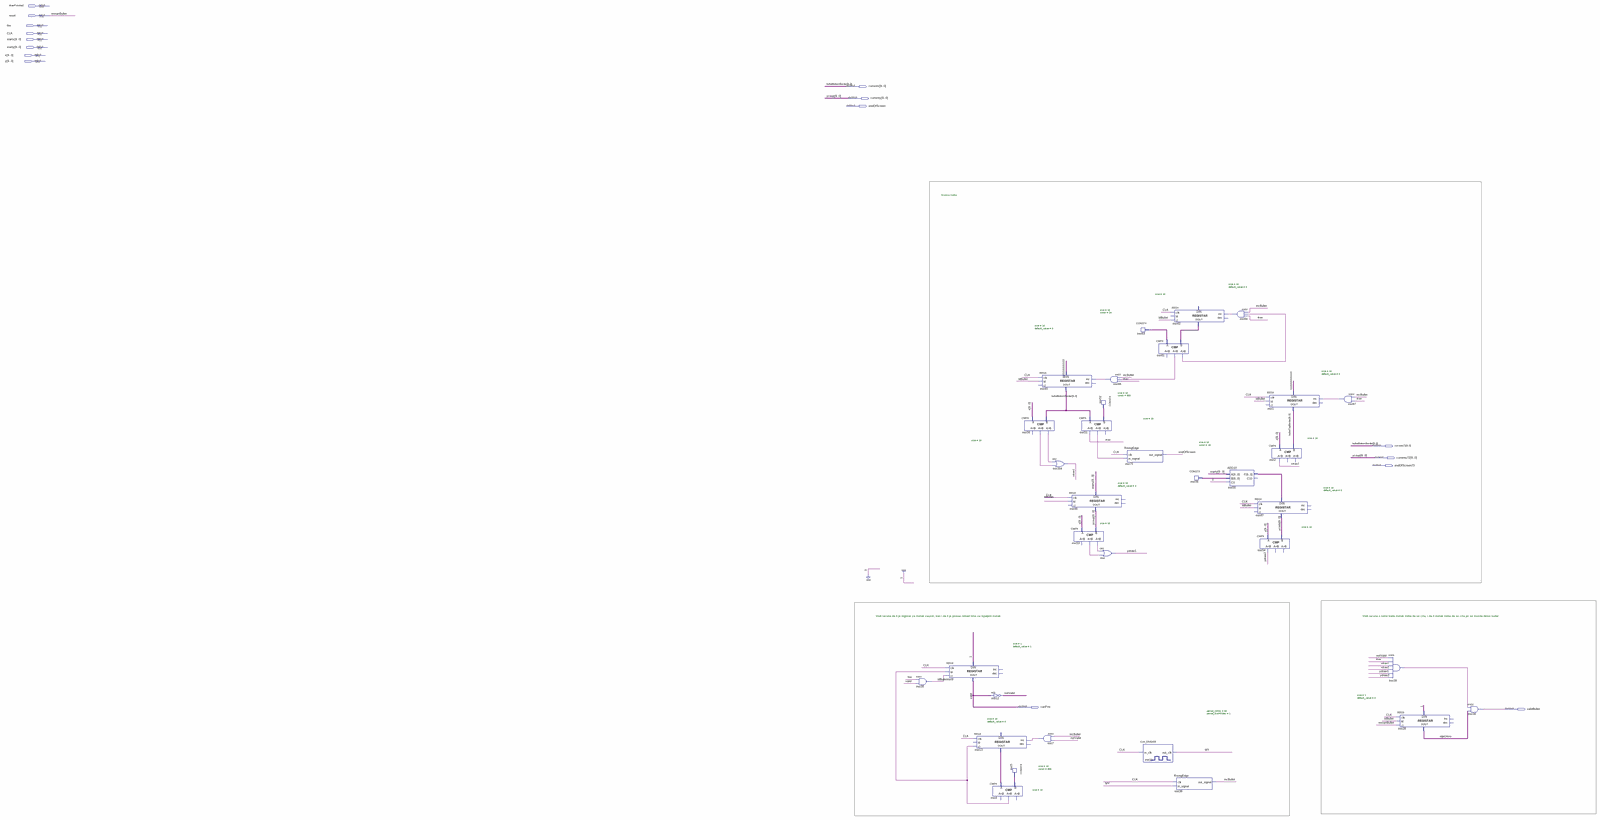
[diagram p0: schematic sheet, whole]
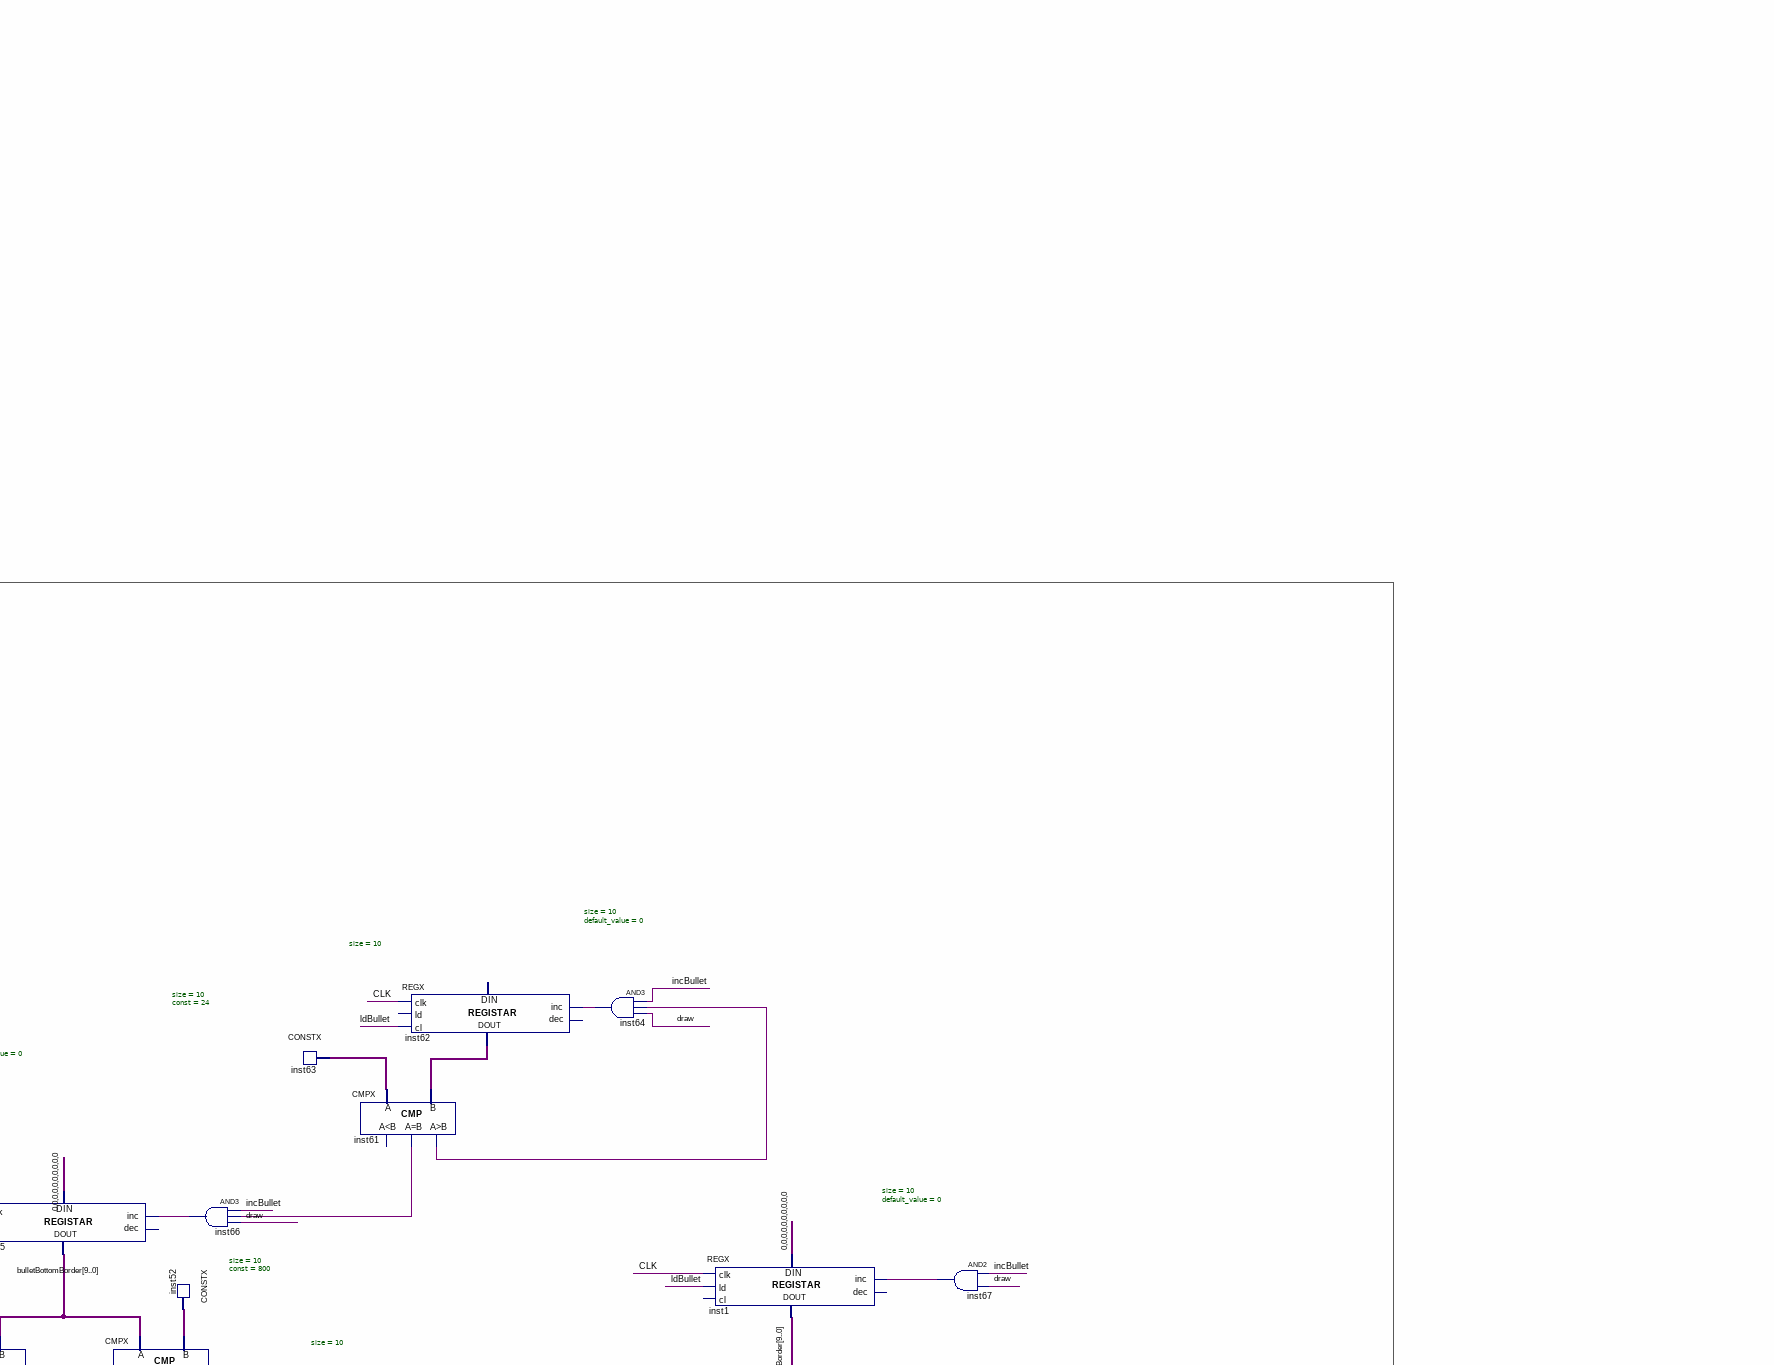
[diagram p1: schematic sheet, upper right part]
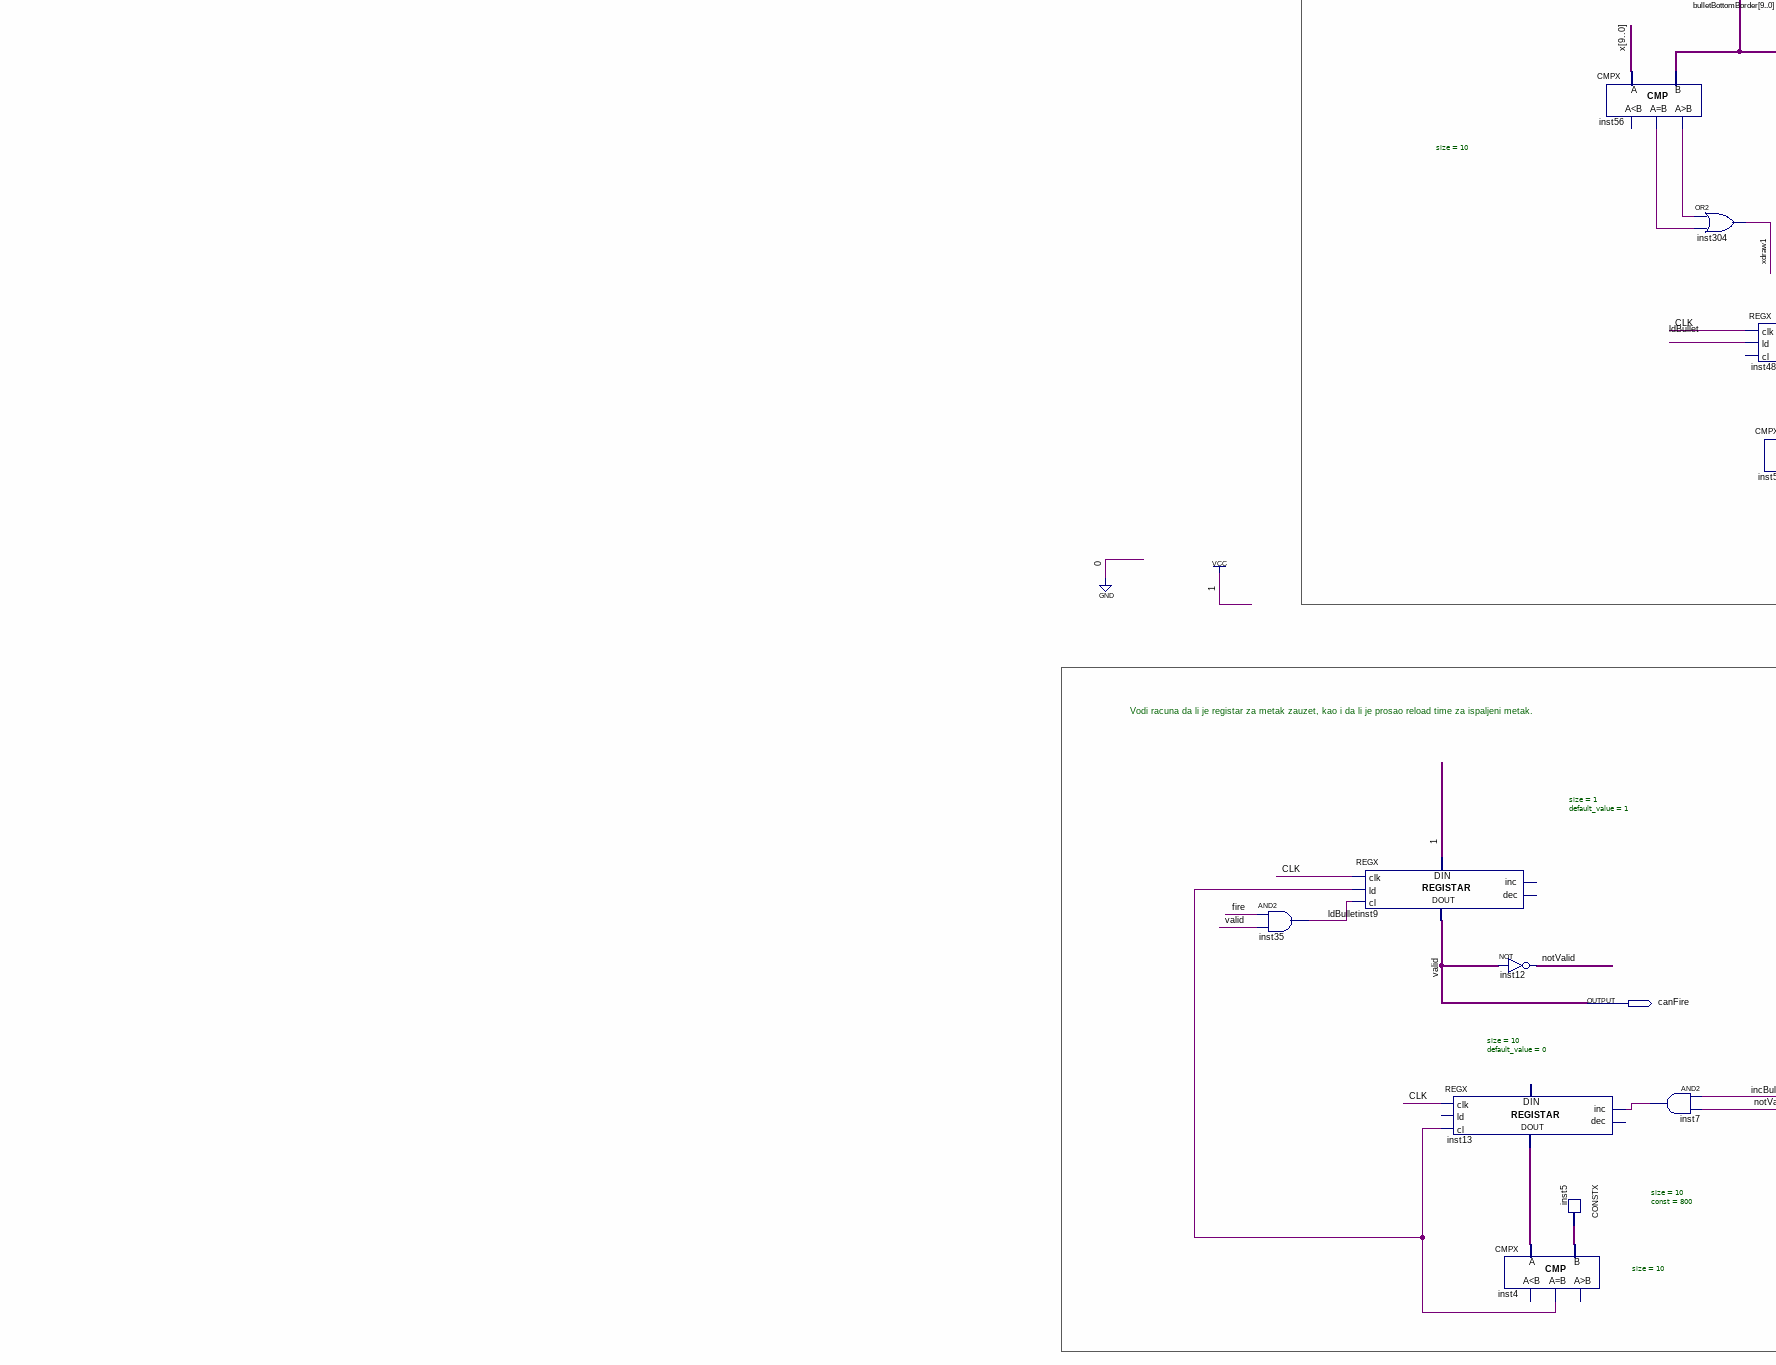
[diagram p2: schematic sheet, lower centre part]
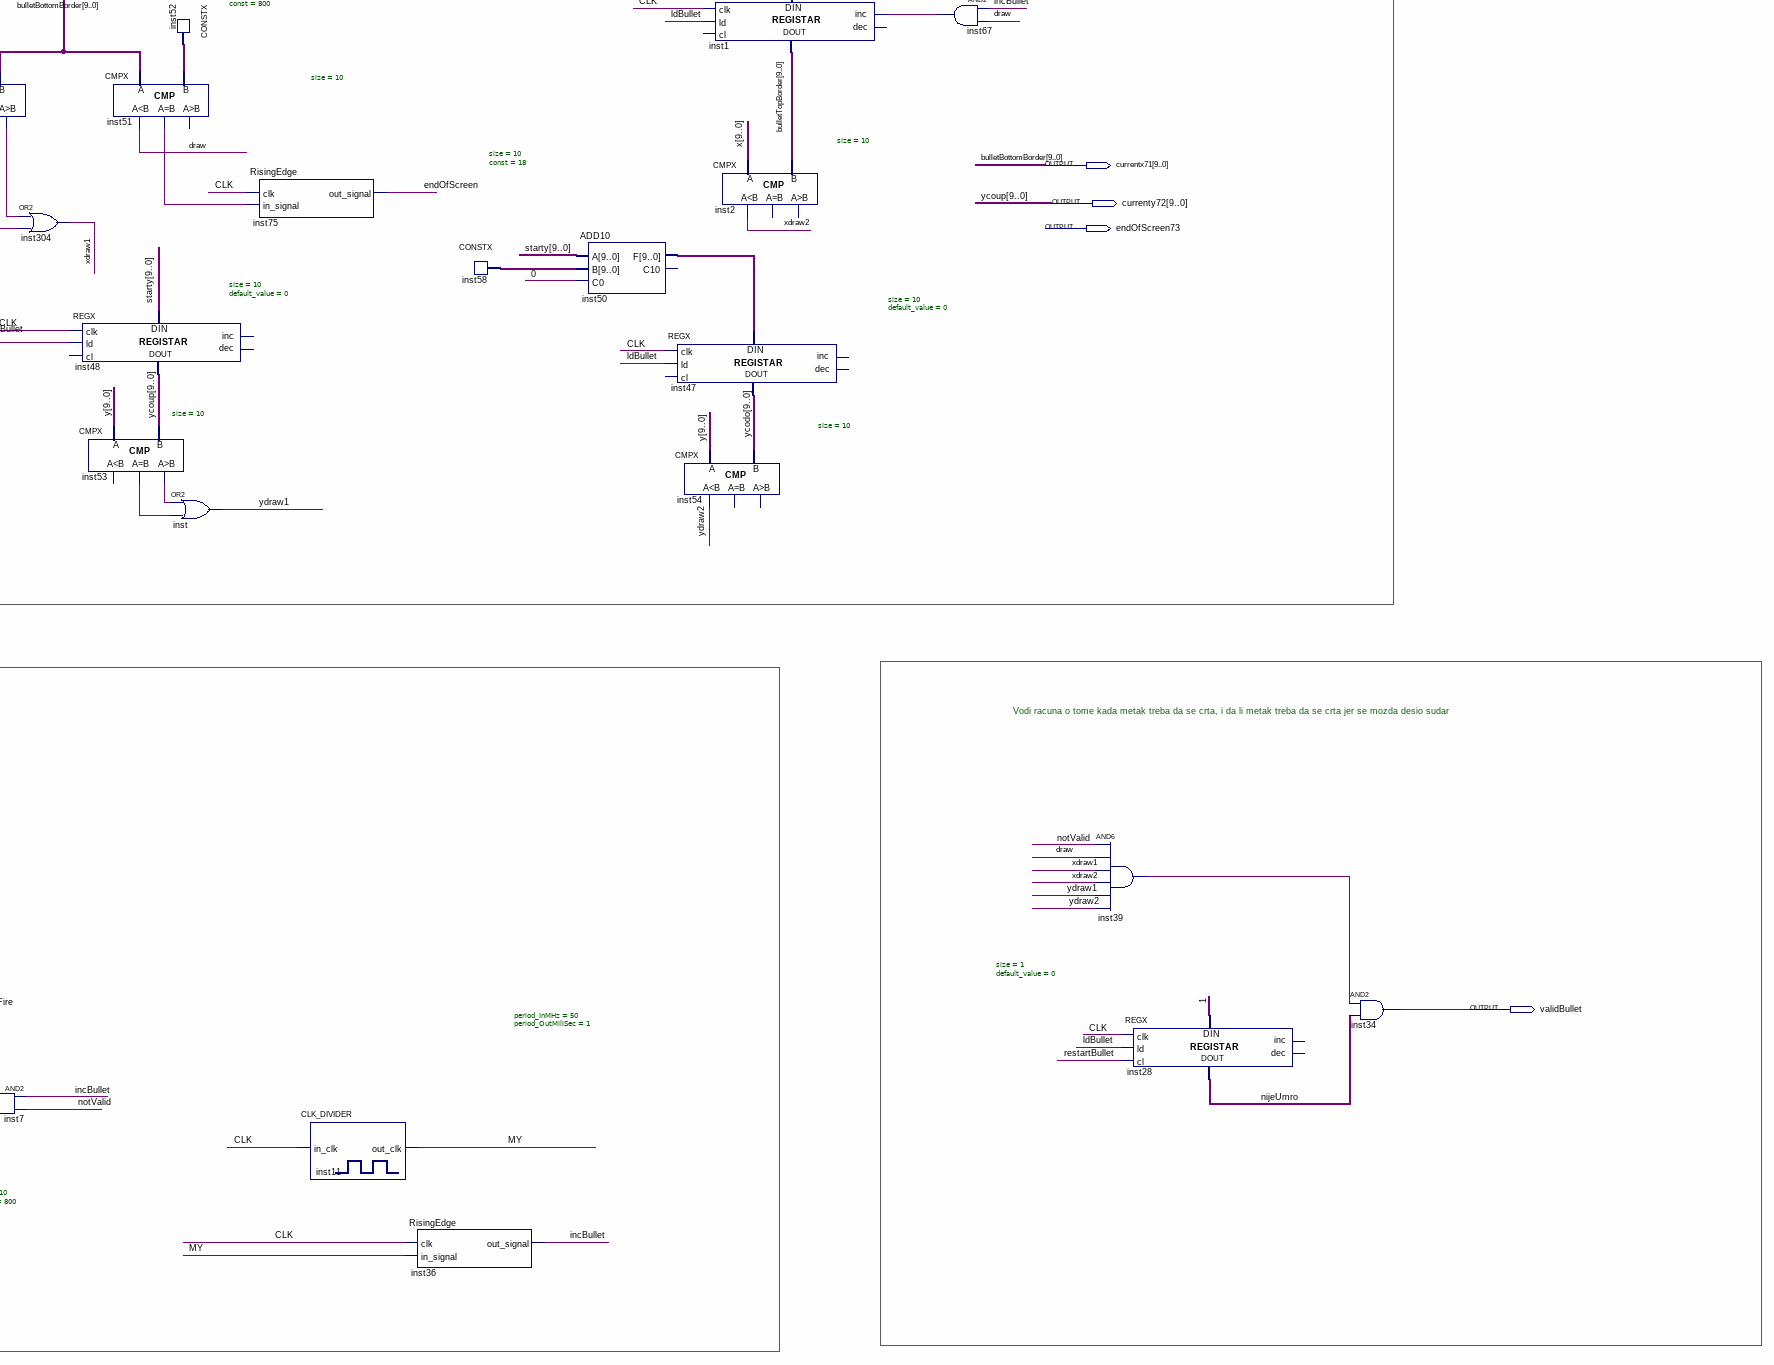
[diagram p3: schematic sheet, lower right part]
// Quartus schematic BulletGoodBoy.bdf as structural Verilog: 33 symbols, 16 pins
module BulletGoodBoy (
  input  drawFinished,
  input  reset,
  input  fire,
  input  CLK,
  input  [9:0] startx,
  input  [9:0] starty,
  input  [9:0] x,
  input  [9:0] y,
  output [9:0] currentx,
  output [9:0] currenty,
  output endOfScreen,
  output [9:0] currentx71,
  output [9:0] currenty72,
  output endOfScreen73,
  output canFire,
  output validBullet
);

  wire draw, incBullet, inst4_eq, inst7_out, inst39_out, inst51_eq, inst53_eq, inst53_gr, inst56_eq,
       inst56_gr, inst61_eq, inst61_gr, inst64_out, inst66_out, inst67_out, ldBullet, MY, nijeUmro, notValid,
       xdraw1, xdraw2, ydraw1, ydraw2;
  wire [9:0] bulletTopBorder, inst5_data, inst13_data_out, inst50_f, inst52_data, inst58_data,
       inst62_data_out, inst63_data, ycodo;

  and inst35 (ldBullet, fire, canFire);
  REGX #(.size(1), .default_value(1)) inst9 (
    .clk(CLK), .ld(inst4_eq), .cl(ldBullet), .data_in(1'b1), .data_out(canFire));  // open: inc, dec
  REGX #(.size(10), .default_value(0)) inst13 (
    .clk(CLK), .cl(inst4_eq), .inc(inst7_out), .data_out(inst13_data_out));  // open: ld, dec, data_in
  not inst12 (notValid, canFire);
  CMPX #(.size(10)) inst4 (.A(inst13_data_out), .B(inst5_data), .eq(inst4_eq));  // open: ls, gr
  CMPX #(.size(10)) inst56 (.A(x), .B(currentx), .eq(inst56_eq), .gr(inst56_gr));  // open: ls
  CONSTX #(.size(10), .\const (800)) inst5 (.data(inst5_data));
  REGX #(.size(10), .default_value(0)) inst45 (
    .clk(CLK), .ld(ldBullet), .inc(inst66_out), .data_in({10{1'b0}}), .data_out(currentx));  // open: cl, dec
  and inst7 (inst7_out, incBullet, notValid);
  or inst304 (xdraw1, inst56_gr, inst56_eq);
  REGX #(.size(10), .default_value(0)) inst48 (
    .clk(CLK), .ld(ldBullet), .data_in(starty), .data_out(currenty));  // open: cl, inc, dec
  CMPX #(.size(10)) inst53 (.A(y), .B(currenty), .eq(inst53_eq), .gr(inst53_gr));  // open: ls
  CMPX #(.size(10)) inst51 (.A(currentx), .B(inst52_data), .ls(draw), .eq(inst51_eq));  // open: gr
  CONSTX #(.size(10), .\const (800)) inst52 (.data(inst52_data));
  or inst (ydraw1, inst53_gr, inst53_eq);
  and inst66 (inst66_out, incBullet, inst61_eq, draw);
  RisingEdge inst75 (.clk(CLK), .in_signal(inst51_eq), .out_signal(endOfScreen));
  CONSTX #(.size(10), .\const (24)) inst63 (.data(inst63_data));
  CLK_DIVIDER #(.period_InMHz(50), .period_OutMiliSec(1)) inst11 (.in_clk(CLK), .out_clk(MY));
  CMPX #(.size(10)) inst61 (.A(inst63_data), .B(inst62_data_out), .eq(inst61_eq), .gr(inst61_gr));  // open: ls
  REGX #(.size(10), .default_value(0)) inst62 (
    .clk(CLK), .cl(ldBullet), .inc(inst64_out), .data_out(inst62_data_out));  // open: ld, dec, data_in
  RisingEdge inst36 (.clk(CLK), .in_signal(MY), .out_signal(incBullet));
  CONSTX #(.size(10), .\const (18)) inst58 (.data(inst58_data));
  ADD10 inst50 (.A(starty), .B(inst58_data), .C0(1'b0), .F(inst50_f));  // open: C10
  and inst64 (inst64_out, incBullet, inst61_gr, draw);
  REGX #(.size(10), .default_value(0)) inst47 (
    .clk(CLK), .ld(ldBullet), .data_in(inst50_f), .data_out(ycodo));  // open: cl, inc, dec
  CMPX #(.size(10)) inst54 (.A(y), .B(ycodo), .ls(ydraw2));  // open: eq, gr
  REGX #(.size(10), .default_value(0)) inst1 (
    .clk(CLK), .ld(ldBullet), .inc(inst67_out), .data_in({10{1'b0}}), .data_out(bulletTopBorder));  // open: cl, dec
  CMPX #(.size(10)) inst2 (.A(x), .B(bulletTopBorder), .ls(xdraw2));  // open: eq, gr
  and inst67 (inst67_out, incBullet, draw);
  and inst39 (inst39_out, notValid, draw, xdraw1, xdraw2, ydraw1, ydraw2);
  REGX #(.size(1), .default_value(0)) inst28 (
    .clk(CLK), .ld(ldBullet), .cl(reset), .data_in(1'b1), .data_out(nijeUmro));  // open: inc, dec
  and inst34 (validBullet, inst39_out, nijeUmro);

  assign currentx71 = currentx;
  assign currenty72 = currenty;

  // Other names for the same wires on the sheet: bulletBottomBorder[9:0] = currentx; restartBullet = reset;
  //   valid = canFire; ycoup[9:0] = currenty

  // Notes on the sheet:
  //   Granice metka                                                                                                     
  //   Vodi racuna da li je registar za metak zauzet, kao i da li je prosao reload time za ispaljeni metak.
  //   Vodi racuna o tome kada metak treba da se crta, i da li metak treba da se crta jer se mozda desio sudar                      
endmodule
